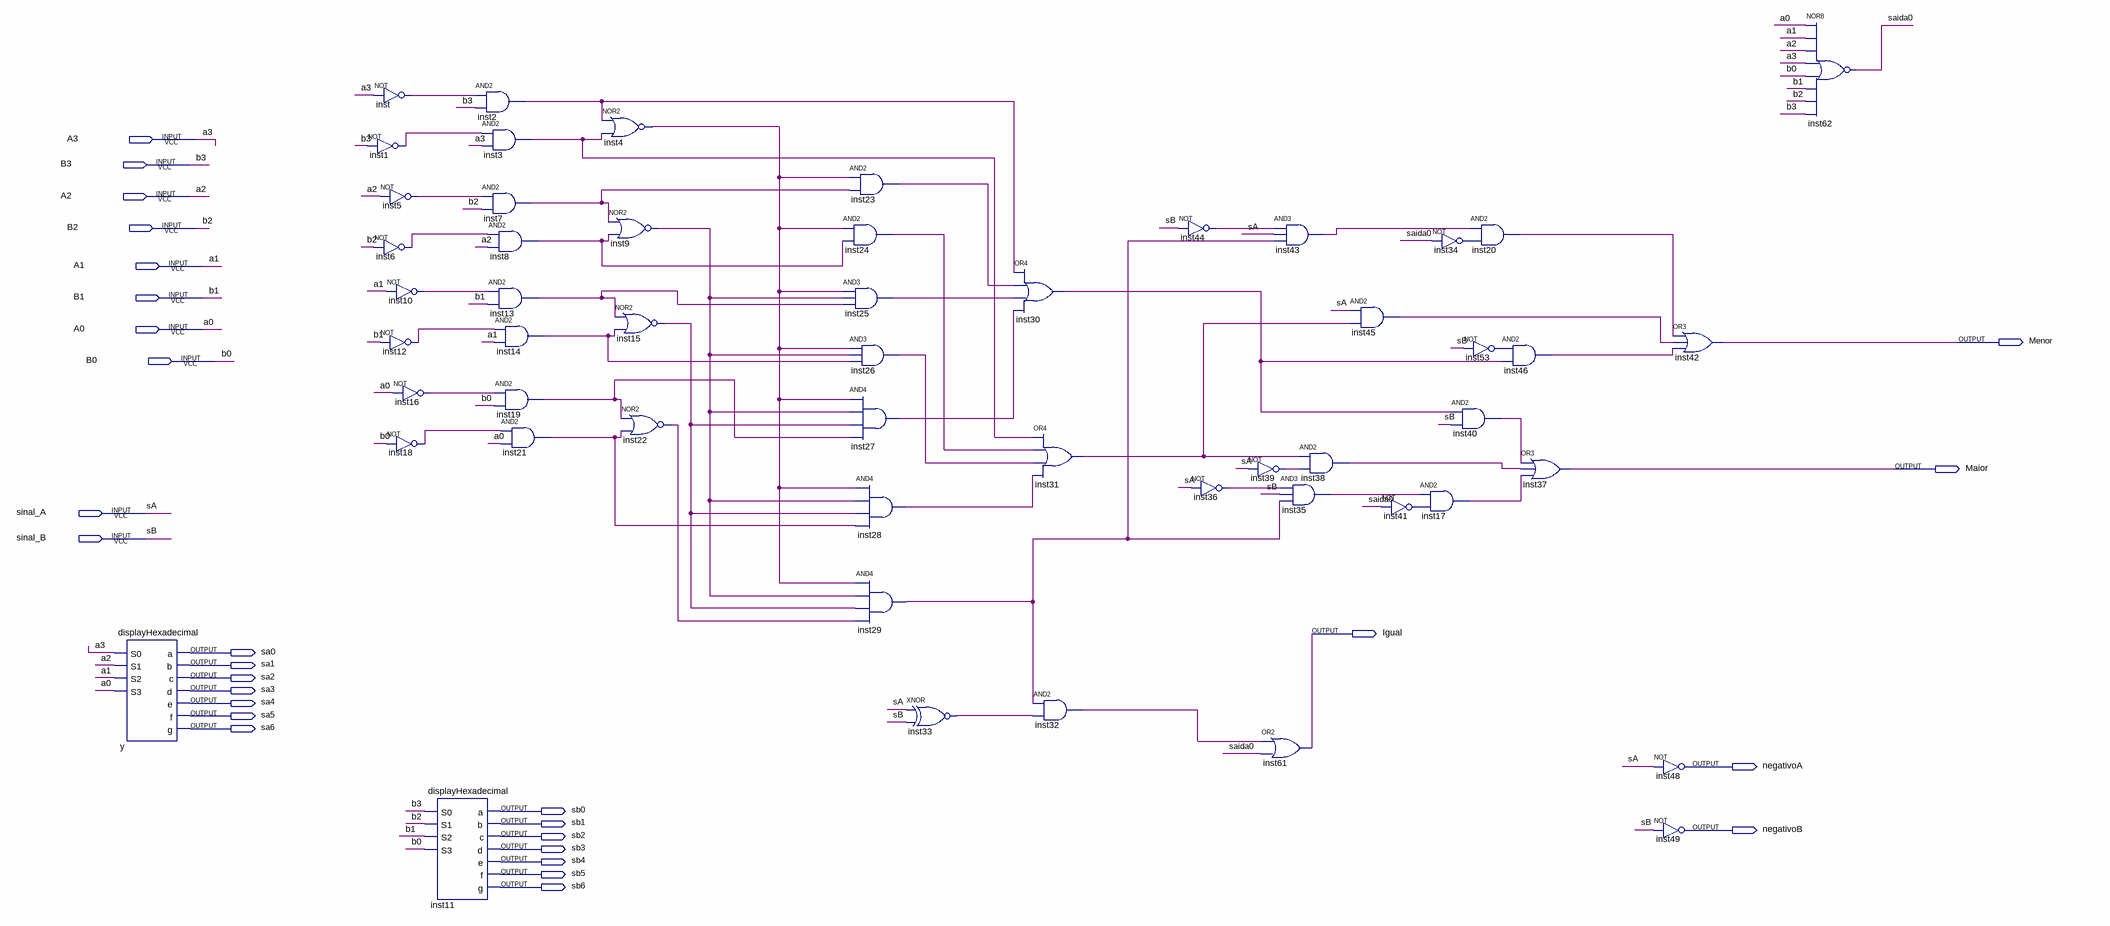
[diagram p0: schematic sheet]
// Quartus schematic aula13.bdf as structural Verilog: 53 symbols, 29 pins
module aula13 (
  input  A3,
  input  B3,
  input  A2,
  input  B2,
  input  A1,
  input  B1,
  input  A0,
  input  B0,
  input  sinal_A,
  input  sinal_B,
  output Menor,
  output Maior,
  output Igual,
  output sa0,
  output sa1,
  output sa2,
  output sa3,
  output sa4,
  output sa5,
  output sa6,
  output negativoA,
  output sb0,
  output sb1,
  output negativoB,
  output sb2,
  output sb3,
  output sb4,
  output sb5,
  output sb6
);

  wire inst1_out, inst2_out, inst3_out, inst4_out, inst5_out, inst6_out, inst7_out, inst8_out, inst9_out,
       inst10_out, inst12_out, inst13_out, inst14_out, inst15_out, inst16_out, inst17_out, inst18_out,
       inst19_out, inst20_out, inst21_out, inst22_out, inst23_out, inst24_out, inst25_out, inst26_out,
       inst27_out, inst28_out, inst29_out, inst30_out, inst31_out, inst32_out, inst33_out, inst34_out,
       inst35_out, inst36_out, inst38_out, inst39_out, inst40_out, inst41_out, inst43_out, inst44_out,
       inst45_out, inst46_out, inst53_out, inst_out, saida0;

  displayHexadecimal y (
    .S0(A3), .S1(A2), .S2(A1), .S3(A0), .a(sa0), .b(sa1), .c(sa2), .d(sa3), .e(sa4), .f(sa5), .g(sa6));
  not inst (inst_out, A3);
  not inst1 (inst1_out, B3);
  not inst5 (inst5_out, A2);
  not inst6 (inst6_out, B2);
  not inst10 (inst10_out, A1);
  not inst12 (inst12_out, B1);
  not inst16 (inst16_out, A0);
  not inst18 (inst18_out, B0);
  displayHexadecimal inst11 (
    .S0(B3), .S1(B2), .S2(B1), .S3(B0), .a(sb0), .b(sb1), .c(sb2), .d(sb3), .e(sb4), .f(sb5), .g(sb6));
  and inst2 (inst2_out, inst_out, B3);
  and inst3 (inst3_out, inst1_out, A3);
  and inst7 (inst7_out, inst5_out, B2);
  and inst8 (inst8_out, inst6_out, A2);
  and inst13 (inst13_out, inst10_out, B1);
  and inst14 (inst14_out, inst12_out, A1);
  and inst19 (inst19_out, inst16_out, B0);
  and inst21 (inst21_out, inst18_out, A0);
  nor inst4 (inst4_out, inst2_out, inst3_out);
  nor inst9 (inst9_out, inst7_out, inst8_out);
  nor inst15 (inst15_out, inst13_out, inst14_out);
  nor inst22 (inst22_out, inst19_out, inst21_out);
  and inst23 (inst23_out, inst4_out, inst7_out);
  and inst24 (inst24_out, inst4_out, inst8_out);
  and inst25 (inst25_out, inst4_out, inst9_out, inst13_out);
  and inst26 (inst26_out, inst4_out, inst9_out, inst14_out);
  and inst27 (inst27_out, inst4_out, inst9_out, inst15_out, inst19_out);
  and inst28 (inst28_out, inst4_out, inst9_out, inst15_out, inst21_out);
  and inst29 (inst29_out, inst4_out, inst9_out, inst15_out, inst22_out);
  xnor inst33 (inst33_out, sinal_A, sinal_B);
  or inst30 (inst30_out, inst2_out, inst23_out, inst25_out, inst27_out);
  or inst31 (inst31_out, inst3_out, inst24_out, inst26_out, inst28_out);
  and inst32 (inst32_out, inst29_out, inst33_out);
  not inst44 (inst44_out, sinal_B);
  not inst36 (inst36_out, sinal_A);
  not inst39 (inst39_out, sinal_A);
  and inst43 (inst43_out, inst44_out, sinal_A, inst29_out);
  and inst38 (inst38_out, inst31_out, inst39_out);
  and inst35 (inst35_out, inst36_out, sinal_B, inst29_out);
  or inst61 (Igual, inst32_out, saida0);
  and inst45 (inst45_out, sinal_A, inst31_out);
  not inst41 (inst41_out, saida0);
  not inst34 (inst34_out, saida0);
  and inst40 (inst40_out, inst30_out, sinal_B);
  and inst17 (inst17_out, inst35_out, inst41_out);
  and inst20 (inst20_out, inst43_out, inst34_out);
  and inst46 (inst46_out, inst53_out, inst30_out);
  not inst53 (inst53_out, sinal_B);
  or inst37 (Maior, inst40_out, inst38_out, inst17_out);
  not inst48 (negativoA, sinal_A);
  not inst49 (negativoB, sinal_B);
  or inst42 (Menor, inst20_out, inst45_out, inst46_out);
  nor inst62 (saida0, A0, A1, A2, A3, B0, B1, B2, B3);

  // Other names for the same wires on the sheet: sA = sinal_A; sB = sinal_B
endmodule
